# Altium schematic sheet BuckConverters.SchDoc (part 2 of 2)
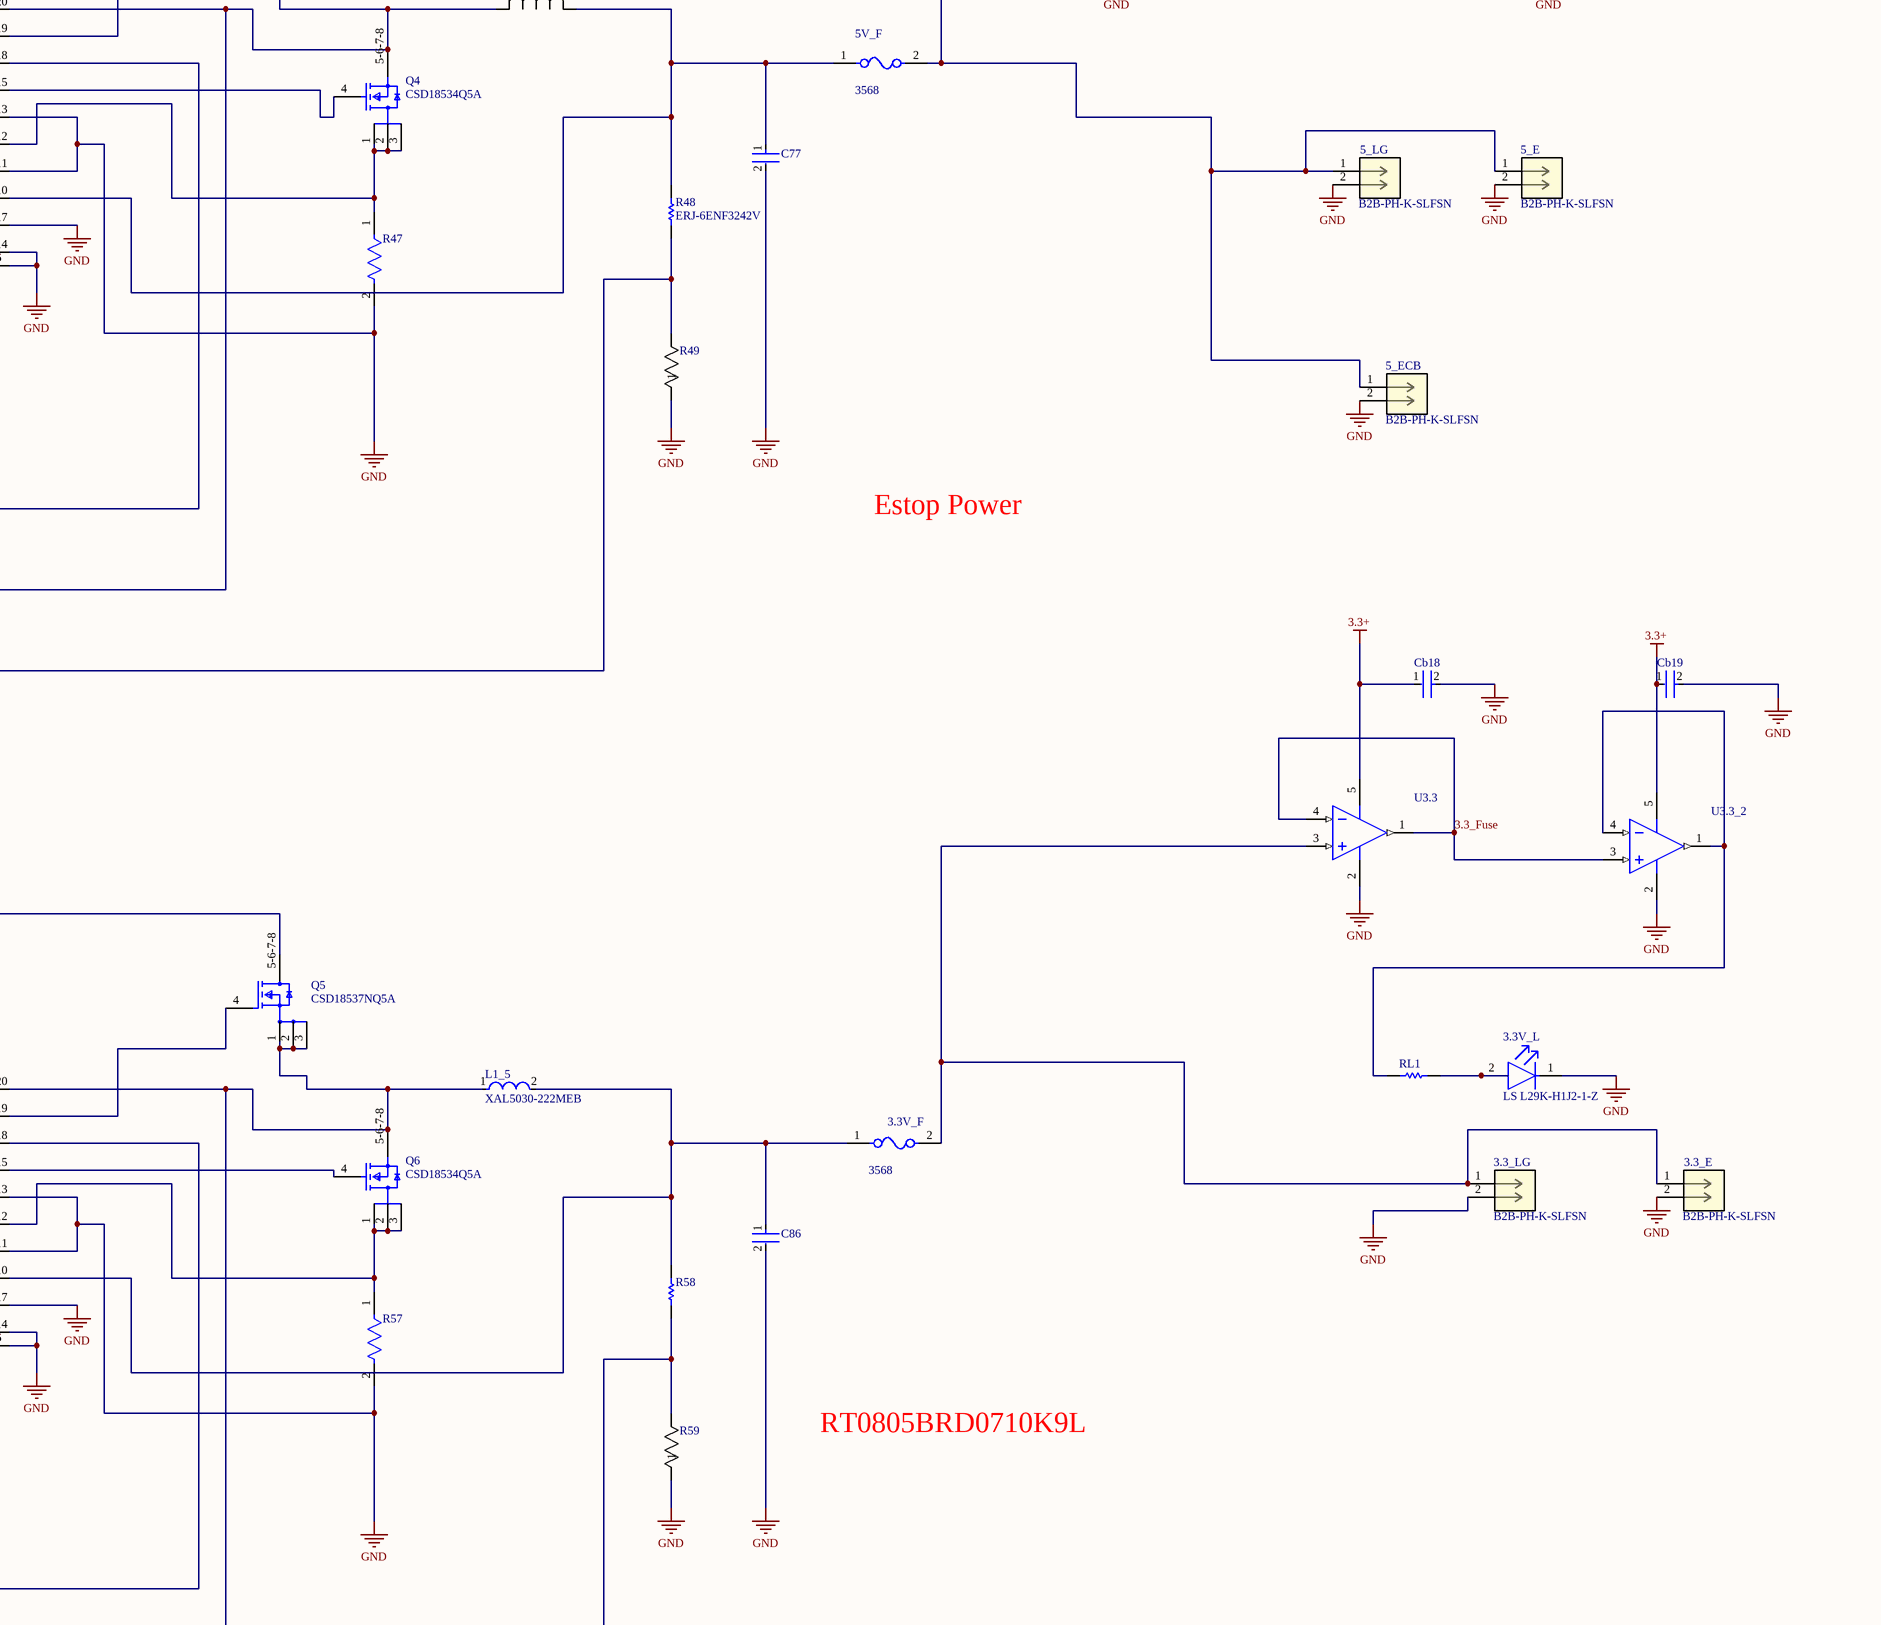
[diagram p8: BuckConverters.SchDoc, row 4 of 4 right]

## Library data of the parts
3.3_E 3.3_LG 5_E 5_ECB 5_LG 12_E 12_ECB RF_LINK = B2B-PH-K-SLFSN: No Description Available; Mfr_Name: JST; RefDes: RefDes; Type: Type
3.3V_F 5V_F AS2_F AS_F Fans_F MCM_F MD2_F MD_F servo_F = CMP-2000-05464-2: NexarPartId: 8116161; Approvals: UL; Body Material: Nylon; Illumination Type: Illuminated; Voltage Rating (AC): 500V; Current Rating: 20A; Number of Poles: 1; Depth: 6.73mm; Max Operating Temperature: 145°C; Length: 16mm; Mount: PCB, Vertical; REACH SVHC: No SVHC; Lead Free: Lead Free; Min Operating Temperature: -50°C; Flammability Rating: UL94 V-0; RoHS: Compliant; Orientation: Vertical; Fuse Current: 20A; Termination: PC Pin; Number of Circuits: 1; Contact Plating: Tin; Voltage: 500V; Contact Material: Brass; Color: Black; Material: Brass, Nylon, Tin
3.3V_L 5V_L AS2_L AS_L Fans_L MCM_L MD_L Motor servo_L = CMP-62016-000041-1: LED RED DIFFUSED 0603 SMD; Reverse Voltage: 12V; Number of LEDs: 1; Dominant Wavelength: 630nm; Forward Current: 20mA; Forward Voltage: 2.2V; Wavelength: 643nm; Luminous Flux: 0.02lm; Viewing Angle: 160°; Luminous Intensity: 7.1mcd; Test Current: 2mA; Radiation Hardening: No; Mount: Surface Mount; Number of Pins: 2; Lens Style: Diffused; Color: Red; Min Operating Temperature: -40°C; Number of Elements: 1; Lead Free: Lead Free; Width: 800um; Packaging: Tape and Reel; Max Operating Temperature: 100°C; Depth: 0.8mm; Case/Package: SMD/SMT; Length: 1.3mm
- P+fans = CMP-1502-01086-3: NexarPartId: 32855538; Contact Resistance: 20mΩ; Current Rating: 3A; Operating Supply Voltage: 250V; Number of Positions: 12; Connector Type: Male Pin; Gender: Male; Pitch: 2.54mm; Number of Pins: 12; Mount: Through Hole; Color: Black; RoHS: Compliant; Contact Plating: Gold; Contact Material: Copper; Packaging: Bulk; Orientation: Vertical; Number of Contacts: 12; Termination: Solder; Contact Mating Length: 5.9944mm; Lead Pitch: 2.54mm; REACH SVHC: Unknown; Number of Rows: 1
AS_1 AS_2 Fans MCM servo = 1720650202: No Description Available; Mfr_Name: Molex Connector Corporation; RefDes: RefDes; Type: Type
C14 C61 C69 C78 Cin2 = CMP-1037-04923-3: Chip Multilayer Ceramic Capacitors for General Purpose, 1206, 4.7uF, X7R, 15%, 10%, 50V; Height: 1.6mm; Voltage: 50V; Capacitance: 4.7uF; Lead Free: Lead Free; Max Operating Temperature: 125°C; Packaging: Tape and Reel; REACH SVHC: No SVHC; Voltage Rating: 50V; Mount: Surface Mount; Termination: SMD/SMT; Tolerance: 10%; Case/Package: 1206; Material: Ceramic; Depth: 1.6mm; Length: 3.2mm; Case Code (Metric): 3216; Voltage Rating (DC): 50V; Case Code (Imperial): 1206; Radiation Hardening: No; Width: 0.063inch; Thickness: 0.071inch; Package Quantity: 2000; Min Operating Temperature: -55°C; Dielectric: X7R
C15 C62 C70 C79 = CMP-1036-04423-3: CAP CER 0.1UF 50V X7R 0805; Manufacturer: KEMET; Tolerance: 0.2; Temperature Coefficient: 30ppm/°C; Material: Ceramic; Capacitance: 0.10 μF; Value: 0.10 μF; Temperature: -55°C to +125°C; RoHS: TRUE; Temperature Range Low: -55°C; Device Class L3: Ceramic Capacitors; Manufacturer Part Number: C0805C104M5RACTU; Octopart: https://octopart.com/c0805c104m5ractu-kemet-129379; Ipc Land Pattern Name: CAPC200125X78; Mouser Description: Multilayer Ceramic Capacitors MLCC - SMD/SMT 50volts 0.1uF X7R 20%; Temperature Range High: +125°C; Package: C0805C-DN; Temperature Characteristic: X7R; Automotive: No; ComponentLink2URL: https://content.kemet.com/datasheets/KEM_C1003_C0G_SMD.pdf; Device Class L1: Passive Components; ComponentLink2Description: Datasheet; Device Class L2: Capacitors; Voltage Rating: 50 V; Digikey Description: CAP CER 0.1UF 50V X7R 0805; Lead Free: Yes; Height: 0.88mm; Category: Cap
C16 = CMP-2008-04334-1: Manufacturer: Murata; Part Number: GRM1555C1H301GA01D
C17 = CMP-1037-03888-2: C1206 33,000 pF C0G 5.00% 100 V; Manufacturer: KEMET; Automotive Grade: Grade 0; Voltage Rating: 100 V; Temperature Coefficient: 15%; Material: Ceramic; Tolerance: 0.05; Temperature: -55°C to +150°C; Octopart: https://octopart.com/c1206c333j1gactu-kemet-47053096; Category: Cap; Temperature Range Low: -55°C; ComponentLink2Description: Datasheet; ComponentLink2URL: https://content.kemet.com/datasheets/KEM_C1007_X8R_ULTRA_150C_SMD.pdf; Mouser Description: Cap Ceramic 0.033uF 100V C0G 5% Pad SMD 1206 125C T/R; Device Class L2: Capacitors; Temperature Range High: +150°C; Device Class L1: Passive Components; Automotive: Yes; Ipc Land Pattern Name: CAPC320160X78; Capacitance: 33,000 pF; Lead Free: Yes; Height: 0.88mm; Package: C1206C-EB; Value: 33,000 pF; RoHS: TRUE; Manufacturer Part Number: C1206C333J1GACTU; Temperature Characteristic: C0G; Device Class L3: Ceramic Capacitors
C18 C71 = UMK105CG181JV-F: No Description Available; Mfr_Name: Taiyo Yuden
C19 C27 C66 = CMP-2008-04115-1: Manufacturer: Murata; Part Number: GRM1555C1E5R1CA01D
C20 C30 C68 C76 C85 = CMP-2007-04739-1: Manufacturer: AVX Interconnect / Elco; Part Number: 08053C104K4T2A
C21 C31 C67 C75 C84 = TMK212BJ105KG-T: No Description Available; Mfr_Name: Taiyo Yuden
C22-C24 = CMP-08246-000988-1: Cap Ceramic 47uF 16V X7R 20% Pad SMD 2220 +125°C Automotive T/R; Length: 5.7mm; Packaging: Tape and Reel; Width: 5mm; Case Code (Imperial): 2220; Thickness: 0.091inch; Lead Free: Lead Free; Capacitance: 47uF; Voltage Rating (DC): 16V; Mount: Surface Mount; Composition: Ceramic; Termination: SMD/SMT; Ratings: AEC-Q200; Case/Package: 2220; Weight: 0.016932oz; REACH SVHC: No SVHC; Voltage Rating: 16V; Max Operating Temperature: 125°C; Case Code (Metric): 5750; Package Quantity: 1; Min Operating Temperature: -55°C; Depth: 5mm; Height: 2.3mm; Tolerance: 20%; Dielectric: X7R
C25 C63 C74 = CMP-14477-003725-2: None; Capacitance: 270pF; Temperature Coefficient: 30ppm/°C; Voltage Rating: 50V; Dielectric: C0G; Tolerance: 5%; Number of Pins: 2; REACH SVHC: No SVHC; Termination: SMD/SMT; Lead Free: Lead Free; Depth: 0.5mm; Case/Package: 0402; Length: 1mm; Packaging: Tape and Reel; Radiation Hardening: No; Height: 0.5mm; Halogen Free: Halogen Free; Width: 0.02inch; Mount: Surface Mount; RoHS Compliant: Yes; Min Operating Temperature: -55°C; Package Quantity: 10000; Thickness: 0.022inch; Case Code (Imperial): 0402; Max Operating Temperature: 125°C; Case Code (Metric): 1005; Voltage Rating (DC): 50V; Series: M; Construction: Flat
C26 C64 C72 C81 = CGA4J2C0G1H333J125AA: No Description Available; Mfr_Name: TDK
C28 C65 C80 = CMP-06035-063004-1: CAP CER 100PF 50V C0G/NP0 0402; Material: Ceramic; Tolerance: 1%; Temperature Coefficient: 30ppm/°C; Dielectric: C0G; Length: 1mm; Mount: Surface Mount; Package Quantity: 10000; Min Operating Temperature: -55°C; Voltage: 50V; Capacitance: 100pF; Voltage Rating: 50V; RoHS Compliant: Yes; Width: 0.5mm; Series: GRM; Construction: Flat; Voltage Rating (DC): 50V; Height: 0.5mm; Case Code (Imperial): 0402; Case Code (Metric): 1005; Case/Package: 0402; Termination: SMD/SMT; Depth: 0.5mm; Packaging: Tape and Reel; Max Operating Temperature: 125°C; Lead Free: Lead Free; Thickness: 0.022inch
C40 = CMP-05428-001123-1: Conductive Polymer Aluminum Solid Capacitors (OS-CON) 27uF ±20% 25V; Ripple Current (AC): 2.45A; Polarity: Polar; Dissipation Factor: 12%; ESR (Equivalent Series Resistance): 40mR; Life (Hours): 5000Hour; Leakage Current: 135uA; Diameter: 5mm; Voltage Rating (DC): 25V; Series: OS-CON™, SVPF; Height - Seated (Max): 0.236inch; Length: 5.9mm; Max Operating Temperature: 105°C; Voltage Rating: 25V; Ripple Current: 2.45A; Package Quantity: 1500; Voltage: 25V; Number of Pins: 6; Height: 5.9mm; Capacitance: 27uF; Min Operating Temperature: -55°C; RoHS Compliant: Yes; Case/Package: Radial; REACH SVHC: No SVHC; Tolerance: 20%; Packaging: Tape and Reel; Mount: Surface Mount; Termination: SMD/SMT
C41 C42 = CMP-05428-000019-2: Conductive Polymer Aluminum Solid Capacitors (OS-CON) 22uF ±20% 35V; Ripple Current (AC): 2.6A; ESR (Equivalent Series Resistance): 35mR; Leakage Current: 154uA; Life (Hours): 5000Hour; Polarity: Polar; Dissipation Factor: 12%; RoHS Compliant: Yes; Voltage Rating: 35V; Capacitance: 22uF; Tolerance: 20%; Case/Package: Radial; Diameter: 6.3mm; Series: OS-CON™, SVPF; Packaging: Tape and Reel; Number of Pins: 6; Max Operating Temperature: 105°C; Voltage Rating (DC): 35V; Ripple Current: 2.6A; REACH SVHC: No SVHC; Voltage: 35V; Min Operating Temperature: -55°C; Mount: Surface Mount; Termination: SMD/SMT; Height: 5.9mm; Length: 5.9mm; Package Quantity: 1000; Height - Seated (Max): 0.236inch
C73 = CMP-1036-00838-4: CAP CER 10PF 16V 20% NP0 0805; Manufacturer: KEMET; Material: Ceramic; Tolerance: 0.2; Temperature Characteristic: C0G; Temperature Coefficient: 30ppm/°C; Height: 0.88mm; Mouser Description: Multilayer Ceramic Capacitors MLCC - SMD/SMT 16volts 10pF C0G 20%; Device Class L2: Capacitors; Temperature Range Low: -55°C; Manufacturer Part Number: C0805C100M4GACTU; ComponentLink2URL: https://content.kemet.com/datasheets/KEM_C1003_C0G_SMD.pdf; Category: Cap; Octopart: https://octopart.com/c0805c100m4gactu-kemet-16430157; Device Class L1: Passive Components; Capacitance: 10 pF; Temperature: -55°C to +125°C; RoHS: TRUE; Package: C0805C-DN; Device Class L3: Ceramic Capacitors; Automotive: No; Value: 10 pF; Voltage Rating: 16 V; Digikey Description: CAP CER 10PF 16V 20% NP0 0805; Temperature Range High: +125°C; Ipc Land Pattern Name: CAPC200125X78; Lead Free: Yes; ComponentLink2Description: Datasheet
C77 C86 = CMP-2000-06362-2: CAP CER 47UF 16V X5R 1210; Tolerance: 10%; Material: Ceramic; Case Code (Metric): 3225; RoHS Compliant: Yes; Min Operating Temperature: -55°C; Radiation Hardening: No; Voltage: 16V; Package Quantity: 1; Case Code (Imperial): 1210; REACH SVHC: No SVHC; Capacitance: 47uF; Voltage Rating (DC): 16V; Dielectric: X5R; Case/Package: 1210; Length: 3.2mm; Voltage Rating: 16V; Packaging: Cut Tape; Width: 0.098inch; Number of Pins: 2; Lead Free: Lead Free; Height: 2.5mm; Mount: Surface Mount; Termination: SMD/SMT; Max Operating Temperature: 85°C; Thickness: 0.106inch; Depth: 2.5mm
C82 = CMP-2008-03987-1: Manufacturer: Murata; Part Number: GRM1555C1E120JA01D
C83 = CMP-2008-04006-2: Chip Multilayer Ceramic Capacitors for General Purpose, 0402, 390pF, C0G, 30ppm/°C, 5%, 50V; Termination: SMD/SMT; Max Operating Temperature: 125°C; Voltage: 50V; Packaging: Tape and Reel; Case Code (Imperial): 0402; Voltage Rating (DC): 50V; Case/Package: 0402; Case Code (Metric): 1005; Package Quantity: 1; Capacitance: 390pF; Length: 1mm; Depth: 0.5mm; Mount: Surface Mount; Voltage Rating: 50V; Tolerance: 5%; Min Operating Temperature: -55°C; Dielectric: C0G; Height: 0.5mm; Radiation Hardening: No; Thickness: 0.022inch; Width: 0.02inch
Cb1-Cb9 Cb11-Cb19 Cbp Cbp2 = CMP-06035-047895-1: Cap Ceramic 0.1uF 100V X7R 10% Pad SMD 0603 Soft Termination +125°C Automotive T/R; Capacitance: 100nF; Thickness: 0.035inch; Tolerance: 10%; Packaging: Tape and Reel; Max Operating Temperature: 125°C; Ratings: AEC-Q200; Case/Package: 0603; Length: 0.063inch; Case Code (Imperial): 0603; Min Operating Temperature: -55°C; Width: 0.031inch; Case Code (Metric): 1608; Voltage Rating: 100V; Features: Soft Termination; Mount: Surface Mount; Lead Free: Lead Free
Cinx2 = CMP-1036-04423-3: CAP CER 0.1UF 50V X7R 0805; Manufacturer: KEMET; Tolerance: 0.2; Temperature Coefficient: 30ppm/°C; Capacitance: 0.10 μF; Value: 0.10 μF; Temperature: -55°C to +125°C; RoHS: TRUE; Temperature Range Low: -55°C; Device Class L3: Ceramic Capacitors; Manufacturer Part Number: C0805C104M5RACTU; Octopart: https://octopart.com/c0805c104m5ractu-kemet-129379; Ipc Land Pattern Name: CAPC200125X78; Mouser Description: Multilayer Ceramic Capacitors MLCC - SMD/SMT 50volts 0.1uF X7R 20%; Temperature Range High: +125°C; Material: Ceramic; Package: C0805C-DN; Temperature Characteristic: X7R; Automotive: No; ComponentLink2URL: https://content.kemet.com/datasheets/KEM_C1003_C0G_SMD.pdf; Device Class L1: Passive Components; ComponentLink2Description: Datasheet; Device Class L2: Capacitors; Voltage Rating: 50 V; Digikey Description: CAP CER 0.1UF 50V X7R 0805; Lead Free: Yes; Height: 0.88mm; Category: Cap
CR15 = SMCJ75A-13-F: No Description Available; Mfr_Name: Diodes Inc
D1-D5 = BAS516: No Description Available; Mfr_Name: Nexperia
J2 = PPTC021LFBN-RC: No Description Available; Mfr_Name: Sullins; RefDes: RefDes; Type: Type
JR = SSQ-101-03-G-S: No Description Available; Mfr_Name: Samtec Inc; RefDes: RefDes; Type: Type
K1 K2 = CMP-00287-65278423-1: HE1AN-W-DC12V-Y6 HE Series SPST 12 V 90 A PV Type Solar Inverter General Purpose Power Relay; Current Rating: 90A; Coil Current: 160mA; Coil Power: 1.92W; Release Time: 10ms; Operate Time: 30ms; Coil Type: Non-Latching; Coil Resistance: 75Ω; Coil Voltage (DC): 12V; Contact Material: Silver; Termination: PC Pin; NexarPartId: 65278423; Mount: PCB, Through Hole; Lead Free: Lead Free; Relay Type: General Purpose; Min Operating Temperature: -50°C; Number of Pins: 4; Packaging: Bulk; Contact Current Rating: 90A; Throw Configuration: SPST; RoHS: Compliant; Max Operating Temperature: 55°C
L1 = IHLP5050FDER1R8M01: No Description Available; Mfr_Name: Vishay
L1_2 = MSS1038-123MLB: No Description Available; Mfr_Name: Coilcraft
L1_3 = XAL6060-562MEB: No Description Available; Mfr_Name: Coilcraft
L1_4 = SER1052-402MLB: No Description Available; Mfr_Name: Coilcraft
L1_5 = CMP-11268-000050-1: Fixed Inductors 2.2uH 20% 9.7A 14.5mOhms; DC Resistance (DCR): 14.5mR; Shielding: Shielded; Max DC Current: 9.2A; Test Frequency: 100kHz; Self Resonant Frequency: 38MHz; Core Material: Composite; Lead Free: Contains Lead; Inductance: 2.2uH; Max Operating Temperature: 125°C; Termination: SMD/SMT; Min Operating Temperature: -40°C; Height: 3.1mm; Package Quantity: 20; Packaging: Tape and Reel; Tolerance: 20%; Length: 5.68mm; Width: 5.48mm
M1 M1_2-M1_4 Q3 Q5 = CMP-04962-000050-1: MOSFET N-CH 60V 50A 8SON; Power Dissipation: 3.2W; Nominal Vgs: 3V; Turn-On Delay Time: 5.8ns; Turn-Off Delay Time: 14.4ns; Rise Time: 4ns; Drain to Source Resistance: 13mR; Input Capacitance: 1.48nF; Continuous Drain Current (ID): 62A; Fall Time: 3.2ns; Number of Elements: 1; Element Configuration: Single; Gate to Source Voltage (Vgs): 20V; Lead Free: Contains Lead; Max Power Dissipation: 3.2W; Max Operating Temperature: 150°C; Contact Plating: Copper; Mount: Surface Mount; Drain to Source Voltage (Vdss): 60V; REACH SVHC: No SVHC; Radiation Hardening: No; Packaging: Tape and Reel; Package Quantity: 2500; Rds On Max: 13mR; Drain to Source Breakdown Voltage: 60V; Number of Pins: 8; RoHS Compliant: Yes; Min Operating Temperature: -55°C
M2 = CSD16556Q5B: No Description Available; Mfr_Name: Texas Instruments; RefDes: RefDes; Type: TYPE
MD_1 MD_2 = 428192233: No Description Available; Mfr_Name: Molex Connector Corporation; RefDes: RefDes; Type: Type
MP1-MP4 = CMP-03913-89311597-1: 9774050482R WA-SMSI SMT Steel Spacer, M4 Internal non Stop; Min Operating Temperature: -55°C; Material: Steel; RoHS: Compliant; Width: 8.2mm; Max Operating Temperature: 150°C; Length: 5mm; Packaging: Tape and Reel; NexarPartId: 89311597
MP+ MP- = 7461147: 7461147 REDCUBE Power Element Poles, 180A, Press-Fit, M5 Internal Thread, Vertical, WP-BUFU; NexarPartId: 18187424; Number of Contacts: 16; Insulation: Non-Insulated; Contact Material: Copper; Contact Plating: Tin; Max Operating Temperature: 150°C; RoHS: Compliant; Mount: Through Hole; REACH SVHC: Unknown; Material: Brass; Width: 9mm; Packaging: Bulk; Length: 9mm; Termination: Press-Fit; Height: 10.5mm; Current Rating: 180A; Number of Pins: 16; Thread Size: M5; Min Operating Temperature: -55°C; Supplier 1: Digikey; Supplier Part Number 1: 732-3215-ND
Q1 Q2 Q4 Q6 = CMP-04962-000014-1: MOSFET N-CH 60V 8SON; Manufacturer: Texas Instruments; Reverse Recovery Time: 40ns; Input Capacitace At Vds: 1360pF @ 30V; Transconductance: 72S; Gate Charge At Vgs: 17nC @ 10V; Threshold Vgs Max: 2.3V; Threshold Vgs Min: 1.5V; Number Of Channels: 1; Rthja Max: 50°C/W; Continuous Drain Current: 13A; Typ Forward Diode Voltage: 0.8V; Max Forward Diode Voltage: 1V; Gate To Source Voltage: 20V; Depletion Mode: False; Turn Off Delay Time: 15ns; Drain To Source Resistance: 7.8mΩ; Max Junction Temp: +150°C; Pulse Drain Current: 229A; Power Dissipation: 3.1W; Turn On Delay Time: 5.2ns; Reverse Recovery Charge: 54nC; Digikey Description: MOSFET N-CH 60V 8SON; ComponentLink2URL: http://www.ti.com/lit/ds/symlink/csd18534q5a.pdf; Temperature Range High: +150°C; Drain To Source Voltage: 60V; Automotive: No; RoHS: TRUE; Mouser Description: MOSFET 60V N-Ch NexFET Pwr MOSFET; Temperature Range Low: -55°C; Manufacturer Part Number: CSD18534Q5A; Octopart: https://octopart.com/csd18534q5a-texas+instruments-22791040; Device Class L1: Discrete Semiconductors; Device Class L2: Transistors; ComponentLink2Description: Datasheet; Number Of N Channels: 1; Height: 1.1mm; Device Class L3: MOSFETs; Temperature: -55°C to +150°C; Lead Free: Yes; Drain To Source Breakdown Voltage: 60V; Package: DQJ0008A; Category: Trans
R1 R16 R26 R46 R60 = CMP-2002-08314-2: RES Thick Film, 1MΩ, 1%, 0.063W, 100ppm/°C, 0402; Power Rating: 63mW; Voltage Rating (DC): 50V; Resistance: 1MR; Min Operating Temperature: -55°C; Lead Free: Lead Free; Case Code (Imperial): 0402; Packaging: Tape and Reel; Case Code (Metric): 1005; Tolerance: 1%; Number of Terminations: 2; Features: Automotive AEC-Q200; Number of Pins: 2; Max Power Dissipation: 63mW; Height: 0.35mm; Weight: 2.3E-05oz; Package Quantity: 10; Contact Plating: Tin; Temperature Coefficient: 100ppm/°C; Radiation Hardening: No; Length: 1mm; Termination: SMD/SMT; Depth: 0.5mm; Case/Package: 0402; Voltage Rating: 50V; Composition: Thick Film; Width: 0.02inch; Max Operating Temperature: 155°C; Military Standard: Not
R2 R12 R22 R42 R53 = CMP-2001-03906-2: NexarPartId: 39846735; Manufacturer Package Identifier: CRCW0805-e3; Power Rating: 125mW; Voltage Rating: 150V; Temperature Coefficient: 100ppm/°C; Tolerance: 1%; Resistance: 41.2kΩ; Schedule B: 8533210045, 8533210045; Lead Free: Lead Free; Case Code (Imperial): 0805; Max Operating Temperature: 155°C; Features: Automotive AEC-Q200; Military Standard: Not; Depth: 1.25mm; Voltage Rating (DC): 150V; Composition: Thick Film; Contact Plating: Tin; Min Operating Temperature: -55°C; Weight: 5.499807mg; RoHS: Compliant; REACH SVHC: Unknown; Case Code (Metric): 2012; Width: 1.2446mm; Length: 2mm; Case/Package: 0805; Number of Pins: 2; Number of Terminations: 2; Height: 500µm; Radiation Hardening: No; Packaging: Cut Tape; Max Power Dissipation: 125mW; Termination: SMD/SMT
R3 R13 R23 R43 R54 = CMP-2001-00072-1: Manufacturer: Panasonic; Part Number: ERJ-6ENF2491V
R4 R14 R24 R44 R55 = CMP-2002-00118-4: RES Thick Film, 5.23kΩ, 1%, 0.063W, 100ppm/°C, 0402; Max Power Dissipation: 63mW; Resistance: 5.23kR; Working Voltage: 50V; Case Code (Metric): 1005; Military Standard: Not; Lead Free: Lead Free; Height: 0.35mm; Min Operating Temperature: -55°C; Contact Plating: Tin; Length: 1mm; Max Operating Temperature: 155°C; Number of Terminations: 2; Power Rating: 63mW; Packaging: Tape and Reel; Termination: SMD/SMT; Temperature Coefficient: 100ppm/°C; Weight: 2.3E-05oz; Composition: Thick Film; Case Code (Imperial): 0402; Number of Pins: 2; Width: 0.5mm; Depth: 0.5mm; Radiation Hardening: No; Voltage Rating: 50V; Case/Package: 0402; Features: Automotive AEC-Q200; Tolerance: 1%; Voltage Rating (DC): 50V; Package Quantity: 10
R5 = CMP-1011-00737-2: Manufacturer: Vishay Dale; Part Number: CRCW0402102KFKED
R6 = CSNL1206FT3L00: No Description Available; Mfr_Name: Stackpole International
R7 = CMP-2003-02282-2: RES Thick Film, 56kΩ, 1%, 0.25W, 100ppm/°C, 1206; Voltage Rating (DC): 200V; Resistance: 56kR; Power Rating: 250mW; Packaging: Tape and Reel; Case/Package: 1206; Lead Free: Lead Free; Height: 0.55mm; Max Operating Temperature: 155°C; Case Code (Metric): 3216; Tolerance: 1%; Contact Plating: Tin; Min Operating Temperature: -55°C; Termination: SMD/SMT; Voltage Rating: 200V; Number of Pins: 2; Radiation Hardening: No; Military Standard: Not; Depth: 1.6mm; Composition: Thick Film; Number of Terminations: 2; Package Quantity: 10; Temperature Coefficient: 100ppm/°C; Width: 0.063inch; Case Code (Imperial): 1206; Weight: 0.000353oz; Length: 3.2mm; Max Power Dissipation: 250mW; Features: Automotive AEC-Q200
R8 = 3296X-1-102LF: No Description Available; Mfr_Name: Bourns Electronics
R9 R20 R40 R52 = CMP-2100-03664-2: RES 10K OHM 1% 1/10W 0603; Voltage Rating: 75V; Voltage Rating (DC): 50V; Resistance: 10kR; Power Rating: 100mW; Temperature Coefficient: 100ppm/°C; Depth: 0.8mm; Termination: SMD/SMT; Resistor Type: Thick Film; Series: RC; Construction: Rectangular; Features: Moisture Resistant; Packaging: Tape and Reel; Min Operating Temperature: -55°C; Number of Terminations: 2; Lead Pitch: 0.3mm; RoHS Compliant: Yes; Case/Package: 0603; Resistance Tolerance: 1%; Military Standard: Not; Weight: 7.1E-05oz; Number of Pins: 2; Tolerance: 1%; Length: 1.6mm; Case Code (Imperial): 0603; Lead Free: Lead Free; Width: 0.8mm; Max Power Dissipation: 100mW; Height: 0.45mm; Max Operating Temperature: 155°C; Case Code (Metric): 1608; Size Code: 0603
R11 = CMP-1012-00590-3: RES Thick Film, 5.1kΩ, 1%, 0.1W, 100ppm/°C, 0603; Power Rating: 100mW; Voltage Rating (DC): 75V; Resistance: 5.1kR; Width: 0.85mm; Depth: 0.85mm; Military Standard: Not; Package Quantity: 5000; Case Code (Metric): 1608; Length: 1.55mm; Weight: 7.1E-05oz; Packaging: Tape and Reel; Temperature Coefficient: 100ppm/°C; Case Code (Imperial): 0603; Lead Free: Lead Free; Radiation Hardening: No; Contact Plating: Tin; Composition: Thick Film; Max Operating Temperature: 155°C; Termination: SMD/SMT; Case/Package: 0603; Min Operating Temperature: -55°C; Tolerance: 1%; Voltage Rating: 75V; Mount: Surface Mount; Height: 0.45mm
R15 = CMP-2002-08268-4: RES Thick Film, 191kΩ, 1%, 0.063W, 100ppm/°C, 0402; Voltage Rating (DC): 50V; Power Rating: 63mW; Resistance: 191kR; Composition: Thick Film; Radiation Hardening: No; Contact Plating: Tin; Temperature Coefficient: 100ppm/°C; Max Operating Temperature: 155°C; Features: Automotive AEC-Q200; Min Operating Temperature: -55°C; Case/Package: 0402; Tolerance: 1%; Weight: 2.3E-05oz; Height: 0.016inch; Package Quantity: 10; Case Code (Metric): 1005; Termination: SMD/SMT; Depth: 0.5mm; Max Power Dissipation: 63mW; Voltage Rating: 50V; Packaging: Tape and Reel; Length: 1mm; Case Code (Imperial): 0402; Width: 0.5mm; Lead Free: Lead Free; Number of Pins: 2; Number of Terminations: 2; Military Standard: Not
R17 = CMP-26527-006578-1: General Purpose Thick Film Chip Resistor, 1206, 15mΩ, 1%, 0.5W; Temperature Coefficient: 100ppm/°C; Max Power Dissipation: 500mW; Resistance: 15mR; Length: 0.12inch; Mount: Surface Mount; Resistor Type: Thick Film; Number of Terminations: 2; Contact Plating: Tin; Max Operating Temperature: 155°C; Height: 0.026inch; Radiation Hardening: No; Case Code (Imperial): 1206; Width: 0.061inch; Tolerance: 1%; Series: CSR; RoHS Compliant: Yes; Case/Package: 1206; Min Operating Temperature: -55°C; Case Code (Metric): 3216; Packaging: Tape and Reel; Lead Free: Lead Free
R18 R28 = CMP-03412-015018-2: RES 86.6kΩ ±1% 0.063W 0402; Resistance: 86.6kR; Voltage Rating: 50V; Power Rating: 62.5mW; Max Power Dissipation: 63mW; Temperature Coefficient: 100ppm/°C; Min Operating Temperature: -55°C; Weight: 2.3E-05oz; Case/Package: 0402; Max Operating Temperature: 155°C; Features: Moisture Resistant; RoHS Compliant: Yes; Number of Terminations: 2; Resistor Type: Thick Film; Case Code (Metric): 1005; Case Code (Imperial): 0402; Width: 0.5mm; Packaging: Tape and Reel; Length: 0.039inch; Height: 0.015inch; Tolerance: 1%; Series: AC; Termination: SMD/SMT
R19 R29 = CMP-1013-00622-2: Manufacturer: Panasonic; Part Number: ERJ-6ENF9761V
R21 R41 = CMP-1012-00567-3: NexarPartId: 40011875; Tolerance: 1%; Power Rating: 100mW; Temperature Coefficient: 100ppm/°C; Voltage Rating (DC): 50V; Resistance: 3.3kΩ; Military Standard: Not; Case/Package: 0603; Mount: Surface Mount; Lead Free: Lead Free; Packaging: Tape & Reel; Termination: SMD/SMT; Number of Terminations: 2; Composition: Thick Film; Length: 1.6mm; Max Power Dissipation: 100mW; Width: 800µm; Features: Moisture Resistant; Max Operating Temperature: 155°C; Depth: 800µm; Number of Pins: 2; REACH SVHC: No SVHC; Case Code (Imperial): 0603; Case Code (Metric): 0603; RoHS: Compliant; Voltage Rating (AC): 50V; Voltage Rating: 50V; Schedule B: 8533210045, 8533210045; Min Operating Temperature: -55°C; Height: 450µm
R25 = CMP-2002-08203-2: RES Thick Film, 143kΩ, 1%, 0.063W, 100ppm/°C, 0402; Voltage Rating: 50V; Resistance: 143kR; Power Rating: 63mW; Case Code (Metric): 1005; Depth: 0.5mm; Termination: SMD/SMT; Lead Free: Lead Free; Width: 0.5mm; Case Code (Imperial): 0402; Max Operating Temperature: 155°C; Military Standard: Not; Length: 1mm; Min Operating Temperature: -55°C; Tolerance: 1%; Weight: 2.3E-05oz; Package Quantity: 10000; Case/Package: 0402; Number of Pins: 2; Height: 0.35mm; Voltage Rating (DC): 50V; Composition: Thick Film; Radiation Hardening: No; Contact Plating: Tin; Packaging: Tape and Reel; Temperature Coefficient: 100ppm/°C
R27 = CMP-2003-04760-2: 7 mOhms ±1% 1W Chip Resistor Wide 0612 (1632 Metric), Current Sense Thin Film; Resistance: 7mR; Temperature Coefficient: 350ppm/°C; Technology: THIN FILM; RoHS Compliant: Yes; Power Rating: 1W; Tolerance: 1%; Height: 0.024inch; Termination: SMD/SMT; Number of Terminations: 2; Length: 0.063inch; Max Operating Temperature: 125°C; Width: 0.126inch; Resistor Type: Thin Film; Packaging: Tape and Reel; Case/Package: 1206; Case Code (Metric): 3216; Package Quantity: 1; Max Power Dissipation: 1W; Series: PRL; Lead Free: Lead Free; Min Operating Temperature: -55°C; Case Code (Imperial): 1206
R45 = CMP-2002-00162-1: Manufacturer: Vishay Dale; Part Number: CRCW040266K5FKED
R47 R57 = CMP-26527-002803-1: General Purpose Thick Film Chip Resistor, 1206, 12mΩ, 1%, 0.5W; Temperature Coefficient: 100ppm/°C; Max Power Dissipation: 500mW; Resistance: 12mR; Case/Package: 1206; Case Code (Imperial): 1206; Series: CSR; Max Operating Temperature: 155°C; Contact Plating: Tin; Min Operating Temperature: -55°C; Length: 0.12inch; Tolerance: 1%; Width: 0.061inch; Packaging: Tape and Reel; Military Standard: Not; Lead Free: Lead Free; Construction: Rectangular; Depth: 1.55mm; Mount: Surface Mount; RoHS Compliant: Yes; Case Code (Metric): 3216; Resistor Type: Thick Film; Number of Terminations: 2; Height: 0.026inch
R48 = CMP-2001-00129-1: Manufacturer: Panasonic; Part Number: ERJ-6ENF3242V
R49 R59 = RNCF0805BTE10K4: No Description Available; Mfr_Name: Stackpole International
R51 = CMP-2000-06932-2: RES 20K OHM 1% 1/10W 0603; Voltage Rating: 50V; Temperature Coefficient: 100ppm/°C; Power Rating: 100mW; Resistance: 20kR; Height: 0.022inch; REACH SVHC: No SVHC; Case Code (Metric): 1608; Depth: 0.8mm; Tolerance: 1%; Min Operating Temperature: -55°C; Series: RC; RoHS Compliant: Yes; Resistor Type: Thick Film; Max Power Dissipation: 100mW; Features: Moisture Resistant; Max Operating Temperature: 155°C; Package Quantity: 1; Size Code: 0603; Packaging: Tape and Reel; Width: 0.031inch; Length: 0.063inch; Military Standard: Not; Technology: THICK FILM; Number of Terminations: 2; Termination: SMD/SMT; Construction: Rectangular; Case/Package: 0603; Number of Pins: 2; Lead Free: Lead Free; Voltage Rating (DC): 50V; Resistance Tolerance: 1%; Case Code (Imperial): 0603
R56 = CMP-2002-00027-1: Manufacturer: Vishay Dale; Part Number: CRCW040247K5FKED
R58 = CMP-2001-00015-1: Manufacturer: Panasonic; Part Number: ERJ-6ENF1872V
RAS RAS3 RM RM3 = CMP-2005-01988-2: RES SMD 205K OHM 1% 1/2W 1770; Temperature Coefficient: 100ppm/°C; Voltage Rating: 200V; Resistance: 100kR; Power Rating: 500mW; Height: 0.024inch; Min Operating Temperature: -55°C; Radiation Hardening: No; Number of Pins: 2; Weight: 0.000564oz; Number of Terminations: 2; Case Code (Imperial): 1210; Width: 2.5mm; Packaging: Tape and Reel; Package Quantity: 1; Length: 3.2mm; Mount: Surface Mount; Termination: SMD/SMT; Features: Automotive AEC-Q200; Max Operating Temperature: 155°C; Contact Plating: Tin; Composition: Thick Film; Tolerance: 1%; Voltage Rating (DC): 200V; Depth: 2.5mm; Lead Free: Lead Free; Case Code (Metric): 3225; Case/Package: 1210; Max Power Dissipation: 500mW; Military Standard: Not
RAS2 RAS4 RM2 RM4 = CMP-2001-04472-1: Manufacturer: Vishay Dale; Part Number: CRCW080510K0FKEAHP
RJ6 RJ7 = CMP-2001-04896-1: Manufacturer: Vishay Dale; Part Number: CRCW08050000Z0EA
RL1-RL9 = CMP-2001-04104-1: Manufacturer: Vishay Dale; Part Number: CRCW0805750RFKEA
U1-U5 = CMP-0069-01417-3: Wide Range Synchronous Buck Controller, 20-pin TSSOP-EP, Pb-Free; Manufacturer: Texas Instruments; CompType: Switcher; PowerWise: Y; PackageTopMarking: NSUZXYTT*LM25116*MH; PackageDescription: Molded TSSOP, Jedec, 6.5 x 4.4 x 0.9mm Body, 20 Lead, 0.65mm Pitch, Exposed Pad; PinCount: 20; Code_JEDEC: MO-153-ACT; ComponentLink1URL: http://www.ti.com/general/docs/lit/getliterature.tsp?genericPartNumber=LM25116&fileType=pdf; RoHS: Y; ComponentLink1Description: Datasheet URL; PackageReference: PWP0020A
U2_5.5 U2_fans U2_mcm U2_MD U2_servo U2AS U3.3 U3.3_2 U3_MD U3AS U5.5 UAS_1 UAS_2 Ufans Umcm UMD_1 UMD_2 Uservo = CMP-0272-02192-3: 550 uA/Ch, 3 MHz, Rail-to-Rail Output Operational Amplifier, 2.7 to 16 V, -40 to 125 degC, 5-pin SOT23 (DBV5), Green (RoHS & no Sb/Br); Manufacturer: Texas Instruments; CMRR(Min)(dB): 69; Total Supply Voltage(Max)(+5V is 5, +/-5V is 10): 16; Total Supply Voltage(Min)(+5V is 5, +/-5V is 10): 2.7; Slew Rate(Typ)(V/us): 2.4; IIB(Max)(pA): 60; Number of Channels: 1; Vio (25C)(Max)(mV): 5; Iq per channel(Max)(mA): 0.66; Offset Drift(Typ)(uV/C): 2; Rating: Catalog; Sub Family: Low Supply Voltage Amplifier (<=2.7V), Precision Amplifier; GBW(Typ)(MHz): 3; Packing: LARGE T&R; Eco-Plan: Green (RoHS & no Sb/Br); ComponentLink3Description: Package Specification; PackageVersion: 4073253-4/K, 03/2006; DatasheetVersion: SLOS351D; PackageReference: DBV0005A; ComponentLink2Description: Datasheet; ComponentLink2URL: http://www.ti.com/lit/ds/symlink/tlv271.pdf; ComponentLink1URL: http://www.ti.com/; PackageDescription: 5-Pin Plastic Small Outline, Body 1.6 x 2.9 mm, Pitch 0.95 mm; Mounting Technology: Surface Mount; PartNumber: TLV271IDBVR; ComponentLink3URL: http://www.ti.com/litv/pdf/mpds018i; Code_JEDEC: MO-178; ComponentLink1Description: Manufacturer URL
UA = CMP-04903-000072-1: IC GATE AND 1CH 2-INP SOT23-5; Low Level Output Current: 32mA; Number of Gates: 1; Quiescent Current: 10uA; Propagation Delay: 4ns; Logic Function: AND GATE; Number of Inputs: 2; Max Supply Voltage: 5.5V; High Level Output Current: -32mA; Min Supply Voltage: 1.65V; Series: 74LVC; Output Current: 32mA; Weight: 0.000557oz; RoHS Compliant: Yes; Number of Bits: 1; Lead Free: Lead Free; Number of Input Lines: 2; Technology: CMOS; Case/Package: SOT-23-5; Mount: Surface Mount; REACH SVHC: No SVHC; Max Operating Temperature: 125°C; Number of Output Lines: 1; Number of Outputs: 1; Min Operating Temperature: -40°C; Number of Pins: 5; Radiation Hardening: No; Number of Elements: 1; Packaging: Tape and Reel; Number of Circuits: 1; Package Quantity: 3000